# Altium schematic sheet BatteryMonitor.SchDoc
size A
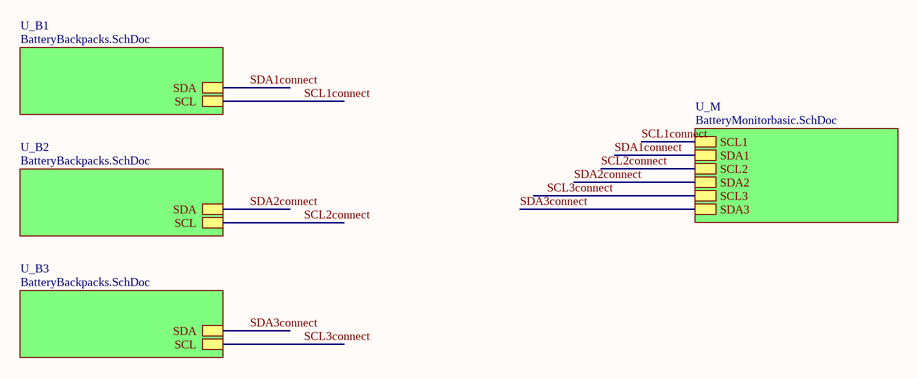
[diagram p0: BatteryMonitor.SchDoc]

## Sub-sheets
U_B1 = BatteryBackpacks.SchDoc: SCL, SDA
U_B2 = BatteryBackpacks.SchDoc: SCL, SDA
U_B3 = BatteryBackpacks.SchDoc: SCL, SDA
U_M = BatteryMonitorbasic.SchDoc: SCL1, SDA1, SCL2, SDA2, SCL3, SDA3

## Nets
SCL1connect: sheet U_B1/SCL, sheet U_M/SCL1
SCL2connect: sheet U_M/SCL2, sheet U_B2/SCL
SCL3connect: sheet U_M/SCL3, sheet U_B3/SCL
SDA1connect: sheet U_B1/SDA, sheet U_M/SDA1
SDA2connect: sheet U_M/SDA2, sheet U_B2/SDA
SDA3connect: sheet U_M/SDA3, sheet U_B3/SDA